# Altium schematic sheet NodoWifi_PWR_R00.SchDoc
size A4; SheetNumber: 2; SheetTotal: 5
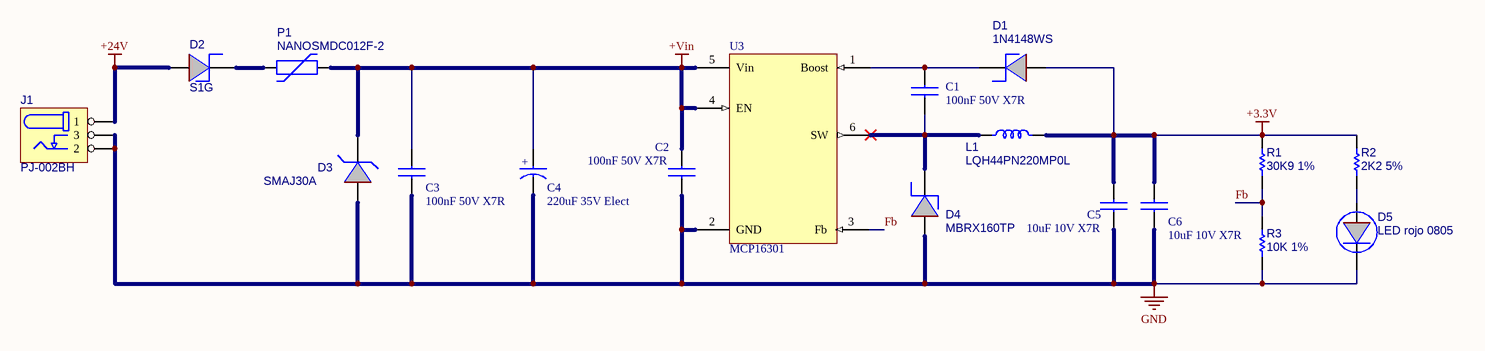
[diagram p0: NodoWifi_PWR_R00.SchDoc]

## Parts
C1  100nF 50V X7R  [C_0805]
C2  100nF 50V X7R  [C_0805]
C3  100nF 50V X7R  [C_1206]
C4  220uF 35V Elect  [C_RAD_0.135_H_8X12_S]
C5  10uF 10V X7R  [C_0805]
C6  10uF 10V X7R  [C_0805]
D1  1N4148WS  [SOD_323]
D2  S1G  [D_SMA]
D3  SMAJ30A  [D_SMA]
D4  MBRX160TP  [SOD_123]
D5  LED rojo 0805  [D_0805]
J1  PJ-002BH  [PJ002B]
L1  LQH44PN220MP0L  [LQH44]
P1  NANOSMDC012F-2  [NANOSMDC]
R1  30K9 1%  [R_0805]
R2  2K2 5%  [R_0805]
R3  10K 1%  [R_0805]
U3  MCP16301  [SOT_23_6]

## Nets
+3.3V: C5.1 C6.1 D1.1(A) L1.2 R1.2 R2.2
+24V: D2.1(A) J1.1
+Vin: C2.1 C3.1 C4.1 D3.2(K) P1.2 U3.4(EN) U3.5(Vin)
GND: C2.2 C3.2 C4.2 C5.2 C6.2 D3.1(A) D4.1(A) D5.2(K) J1.2 J1.3 R3.1 U3.2(GND)
Fb: R1.1 R3.2 U3.3(Fb)
NetC1_1: C1.1 D1.2(K) U3.1(Boost)
NetC1_2: C1.2 D4.2(K) L1.1 U3.6(SW)
NetD2_2: D2.2(K) P1.1
NetD5_1: D5.1(A) R2.1

## Notes on the sheet
- (in symbol Electrolytic Capacitor) +

## Library data of the parts
C1-C3 C5 C6 = Ceramic Capacitor
C4 = Electrolytic Capacitor
D1 D2 D4 = DIODO_SH: Diode Shottky
D3 = DIODE_TVS: Unidirectional TVS
D5 = LED
J1 = CN_PowerJack: Barrel Power Connector
L1 = IND: Inductor
P1 = PLYSW: Polyswitch
R1-R3 = Res1: Resistor
U3 = MCP16301: Integrated Switch Step-Down